# EAGLE design Raincenter_APP_TS_0.02 (EAGLE 6.6.0)
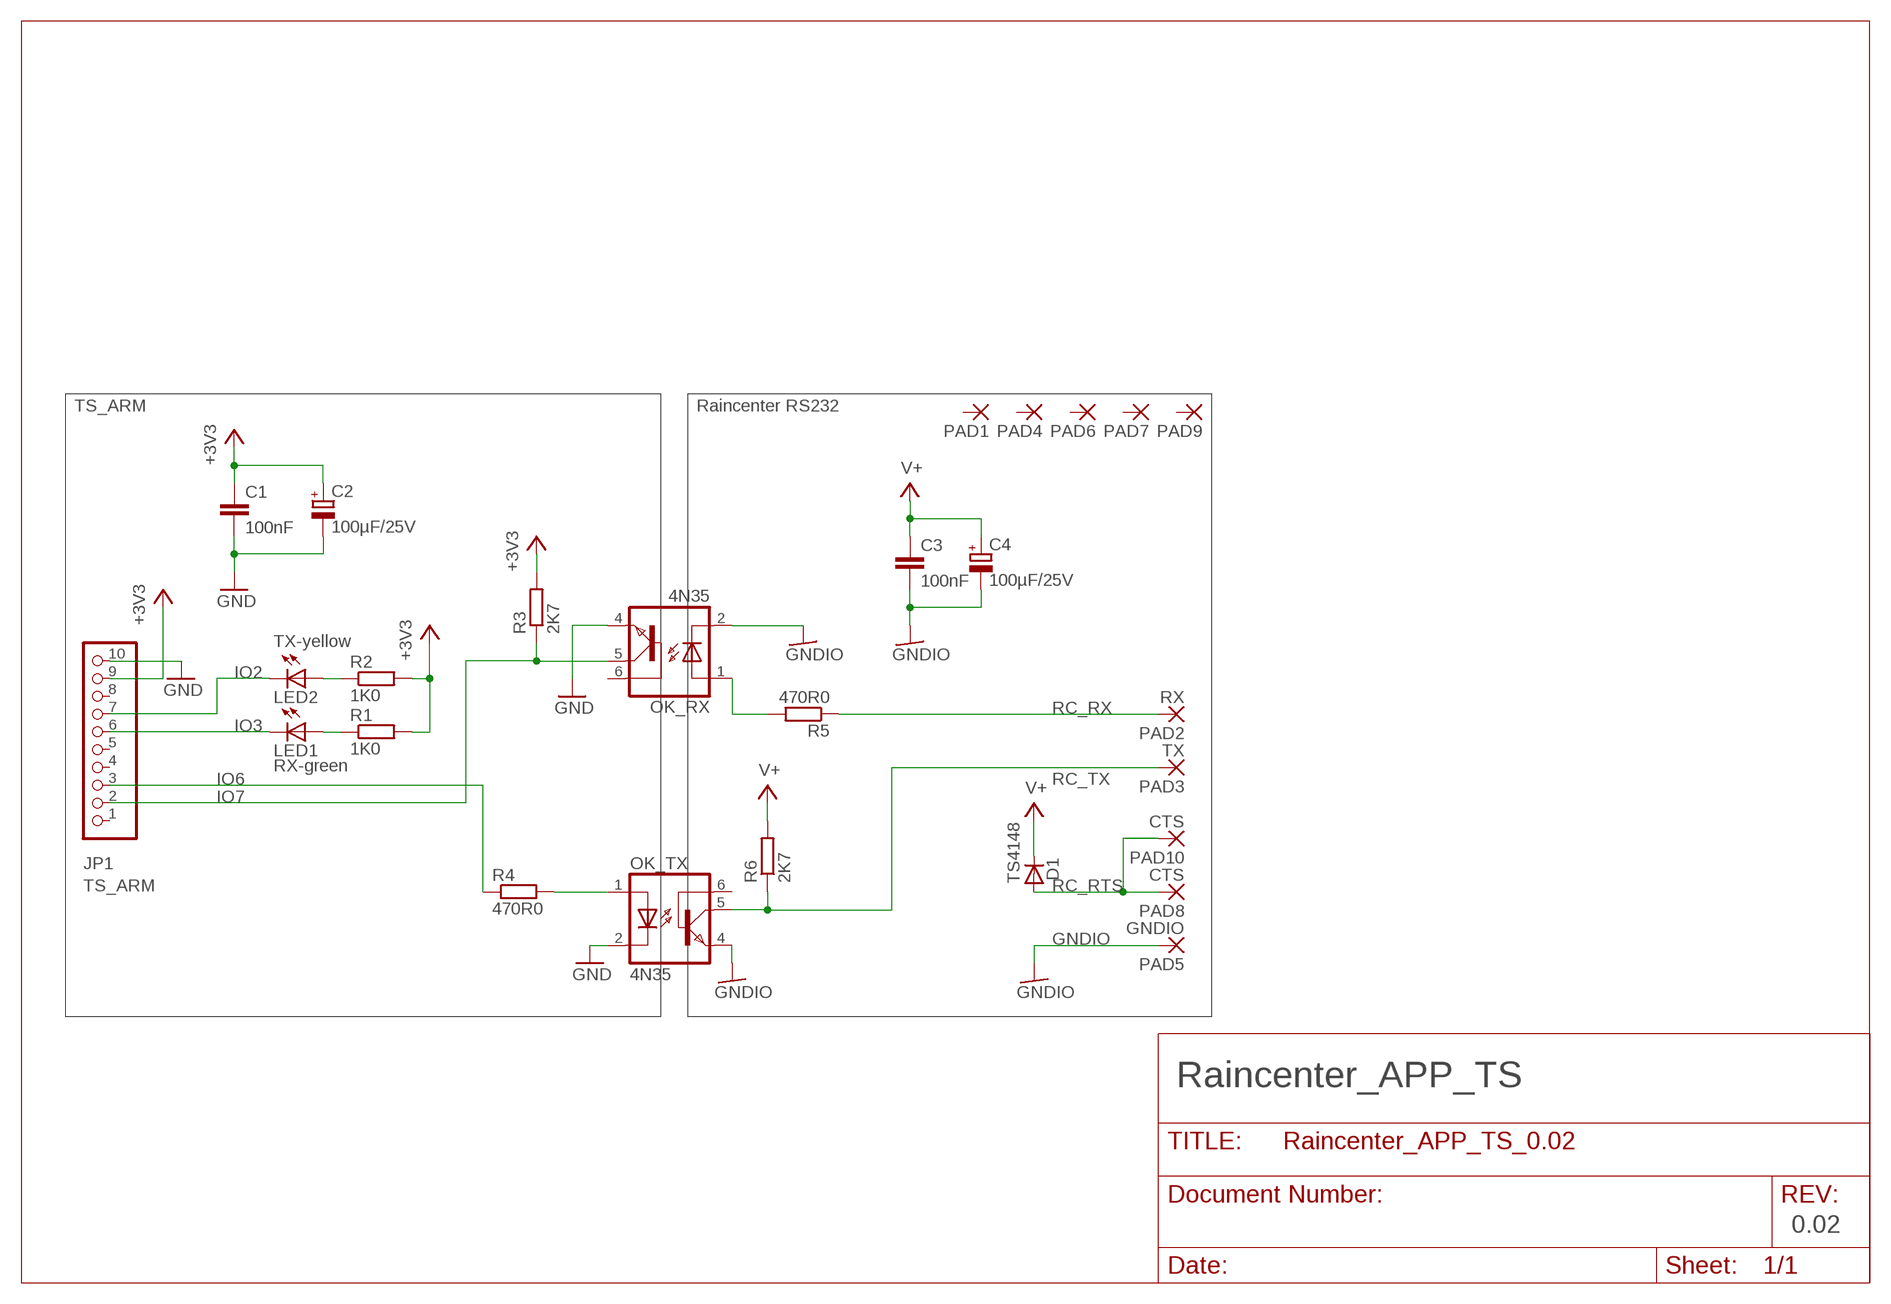
[diagram p0: schematic, sheet 1]

## Parts
C1  100nF  C-EUC1206K  [C1206K]
C2  100µF/25V  CPOL-EUD  [PANASONIC_D]
C3  100nF  C-EUC1206K  [C1206K]
C4  100µF/25V  CPOL-EUD  [PANASONIC_D]
D1  TS4148  [1206]
JP1  TS_ARM  PINHD-1X10  [1X10]
LED1  RX-green  LEDCHIPLED_1206  [CHIPLED_1206]
LED2  TX-yellow  LEDCHIPLED_1206  [CHIPLED_1206]
OK_RX  4N35  [DIL06]
OK_TX  4N35  [DIL06]
PAD1  WIREPADSMD1,27-254  [SMD1,27-2,54]
PAD2  RX  WIREPADSMD1,27-254  [SMD1,27-2,54]
PAD3  TX  WIREPADSMD1,27-254  [SMD1,27-2,54]
PAD4  WIREPADSMD1,27-254  [SMD1,27-2,54]
PAD5  GNDIO  WIREPADSMD1,27-254  [SMD1,27-2,54]
PAD6  WIREPADSMD1,27-254  [SMD1,27-2,54]
PAD7  WIREPADSMD1,27-254  [SMD1,27-2,54]
PAD8  CTS  WIREPADSMD1,27-254  [SMD1,27-2,54]
PAD9  WIREPADSMD1,27-254  [SMD1,27-2,54]
PAD10  CTS  WIREPADSMD1,27-254  [SMD1,27-2,54]
R1  1K0  R-EU_R1206  [R1206]
R2  1K0  R-EU_R1206  [R1206]
R3  2K7  R-EU_R1206  [R1206]
R4  470R0  R-EU_R1206  [R1206]
R5  470R0  R-EU_R1206  [R1206]
R6  2K7  R-EU_R1206  [R1206]

## Nets
+3V3: C1.1 C2.+ JP1.9 R1.2 R2.2 R3.2
GND: C1.2 C2.- JP1.10 OK_RX.4(EMI) OK_TX.2(C)
GNDIO: C3.2 C4.- OK_RX.2(C) OK_TX.4(EMI) PAD5.1(P)
IO2: JP1.7 LED2.C
IO3: JP1.6 LED1.C
IO6: JP1.3 R4.1
IO7: JP1.2 OK_RX.5(COL) R3.1
N$5: LED2.A R2.1
N$8: OK_RX.1(A) R5.2
N$10: OK_TX.1(A) R4.2
N$11: LED1.A R1.1
RC_RTS: D1.ANODE(A) PAD8.1(P) PAD10.1(P)
RC_RX: PAD2.1(P) R5.1
RC_TX: OK_TX.5(COL) PAD3.1(P) R6.1
V+: C3.1 C4.+ D1.KATHODE(K) R6.2
Unconnected: JP1.1 JP1.4 JP1.5 JP1.8 OK_RX.6(BAS) OK_TX.6(BAS) PAD1.1(P) PAD4.1(P) PAD6.1(P) PAD7.1(P) PAD9.1(P)

## Notes on the sheet
- TS_ARM | Raincenter RS232
- Raincenter_APP_TS
- 0.02

## Library data of the parts
C1 C3 = rcl:C-EU: CAPACITOR, European symbol; OC_REICHELT: X7R-G1206 100N
C2 C4 = rcl:CPOL-EU: POLARIZED CAPACITOR, European symbol; OC_REICHELT: VF 100/25 P-D8
D1 = kubi:TS4148; OC_REICHELT: TS 4148-1206
JP1 = pinhead:PINHD-1X10: PIN HEADER
LED1 = led:LED: LED OSRAM: - CHIPLED LG R971, LG N971, LY N971, LG Q971, LY Q971, LO R971, LY R971 LH N974, LH R974 LS Q976, LO Q976, LY Q976 LO Q996 - Hyper CHIPLED LW Q18S LB Q993, LB Q99A, LB R99A - SideLED LS A670, LO A670, LY A670, LG A670, LP A670 LB A673, LV A673, LT A673, LW A673 LH A674 LY A675 LS A676, LA A676, LO A676, LY A676, LW A676 LS A679, LY A679, LG A679 - Hyper Micro SIDELED® LS Y876, LA Y876, LO Y876, LY Y876 LT Y87S - SmartLED LW L88C, LW L88S LB L89C, LB L89S, LG L890 LS L89K, LO L89K, LY L89K LS L896, LA L896, LO L896, LY L896 - TOPLED LS T670, LO T670, LY T670, LG T670, LP T670 LSG T670, LSP T670, LSY T670, LOP T670, LYG T670 LG T671, LOG T671, LSG T671 LB T673, LV T673, LT T673, LW T673 LH T674 LS T676, LA T676, LO T676, LY T676, LB T676, LH T676, LSB T676, LW T676 LB T67C, LV T67C, LT T67C, LS T67K, LO T67K, LY T67K, LW E67C LS E67B, LA E67B, LO E67B, LY E67B, LB E67C, LV E67C, LT E67C LW T67C LS T679, LY T679, LG T679 LS T770, LO T770, LY T770, LG T770, LP T770 LB T773, LV T773, LT T773, LW T773 LH T774 LS E675, LA E675, LY E675, LS T675 LS T776, LA T776, LO T776, LY T776, LB T776 LHGB T686 LT T68C, LB T68C - Hyper Mini TOPLED® LB M676 - Mini TOPLED Santana® LG M470 LS M47K, LO M47K, LY M47K Source: http://www.osram.convergy.de - LUMILED® LXK2-PW12-R00, LXK2-PW12-S00, LXK2-PW14-U00, LXK2-PW14-V00 LXK2-PM12-R00, LXK2-PM12-S00, LXK2-PM14-U00 LXK2-PE12-Q00, LXK2-PE12-R00, LXK2-PE12-S00, LXK2-PE14-T00, LXK2-PE14-U00 LXK2-PB12-K00, LXK2-PB12-L00, LXK2-PB12-M00, LXK2-PB14-N00, LXK2-PB14-P00, LXK2-PB14-Q00 LXK2-PR12-L00, LXK2-PR12-M00, LXK2-PR14-Q00, LXK2-PR14-R00 LXK2-PD12-Q00, LXK2-PD12-R00, LXK2-PD12-S00 LXK2-PH12-R00, LXK2-PH12-S00 LXK2-PL12-P00, LXK2-PL12-Q00, LXK2-PL12-R00 Source: www.luxeon.com; OC_REICHELT: SMD-LED 1206 GN
LED2 = led:LED: LED OSRAM: - CHIPLED LG R971, LG N971, LY N971, LG Q971, LY Q971, LO R971, LY R971 LH N974, LH R974 LS Q976, LO Q976, LY Q976 LO Q996 - Hyper CHIPLED LW Q18S LB Q993, LB Q99A, LB R99A - SideLED LS A670, LO A670, LY A670, LG A670, LP A670 LB A673, LV A673, LT A673, LW A673 LH A674 LY A675 LS A676, LA A676, LO A676, LY A676, LW A676 LS A679, LY A679, LG A679 - Hyper Micro SIDELED® LS Y876, LA Y876, LO Y876, LY Y876 LT Y87S - SmartLED LW L88C, LW L88S LB L89C, LB L89S, LG L890 LS L89K, LO L89K, LY L89K LS L896, LA L896, LO L896, LY L896 - TOPLED LS T670, LO T670, LY T670, LG T670, LP T670 LSG T670, LSP T670, LSY T670, LOP T670, LYG T670 LG T671, LOG T671, LSG T671 LB T673, LV T673, LT T673, LW T673 LH T674 LS T676, LA T676, LO T676, LY T676, LB T676, LH T676, LSB T676, LW T676 LB T67C, LV T67C, LT T67C, LS T67K, LO T67K, LY T67K, LW E67C LS E67B, LA E67B, LO E67B, LY E67B, LB E67C, LV E67C, LT E67C LW T67C LS T679, LY T679, LG T679 LS T770, LO T770, LY T770, LG T770, LP T770 LB T773, LV T773, LT T773, LW T773 LH T774 LS E675, LA E675, LY E675, LS T675 LS T776, LA T776, LO T776, LY T776, LB T776 LHGB T686 LT T68C, LB T68C - Hyper Mini TOPLED® LB M676 - Mini TOPLED Santana® LG M470 LS M47K, LO M47K, LY M47K Source: http://www.osram.convergy.de - LUMILED® LXK2-PW12-R00, LXK2-PW12-S00, LXK2-PW14-U00, LXK2-PW14-V00 LXK2-PM12-R00, LXK2-PM12-S00, LXK2-PM14-U00 LXK2-PE12-Q00, LXK2-PE12-R00, LXK2-PE12-S00, LXK2-PE14-T00, LXK2-PE14-U00 LXK2-PB12-K00, LXK2-PB12-L00, LXK2-PB12-M00, LXK2-PB14-N00, LXK2-PB14-P00, LXK2-PB14-Q00 LXK2-PR12-L00, LXK2-PR12-M00, LXK2-PR14-Q00, LXK2-PR14-R00 LXK2-PD12-Q00, LXK2-PD12-R00, LXK2-PD12-S00 LXK2-PH12-R00, LXK2-PH12-S00 LXK2-PL12-P00, LXK2-PL12-Q00, LXK2-PL12-R00 Source: www.luxeon.com; OC_REICHELT: SMD-LED 1206 GE
OK_RX OK_TX = optocoupler:4N35: MOTOROLA OPTO COUPLER; MF: FAIRCHILD SEMICONDUCTOR; MPN: 4N35; OC_FARNELL: 1328375; OC_NEWARK: 72K9946; OC_REICHELT: 4N 35
PAD1-PAD10 = wirepad:WIREPAD: Wire PAD connect wire on PCB
R1 R2 = rcl:R-EU_: RESISTOR, European symbol; OC_REICHELT: RND 1206 1 1,0K
R3 R6 = rcl:R-EU_: RESISTOR, European symbol; OC_REICHELT: RND 1206 1 2,7K
R4 R5 = rcl:R-EU_: RESISTOR, European symbol; OC_REICHELT: RND 1206 1 470

## Net classes
0 default: width 0.61 mm
2 VCC: width 0.61 mm

## Board
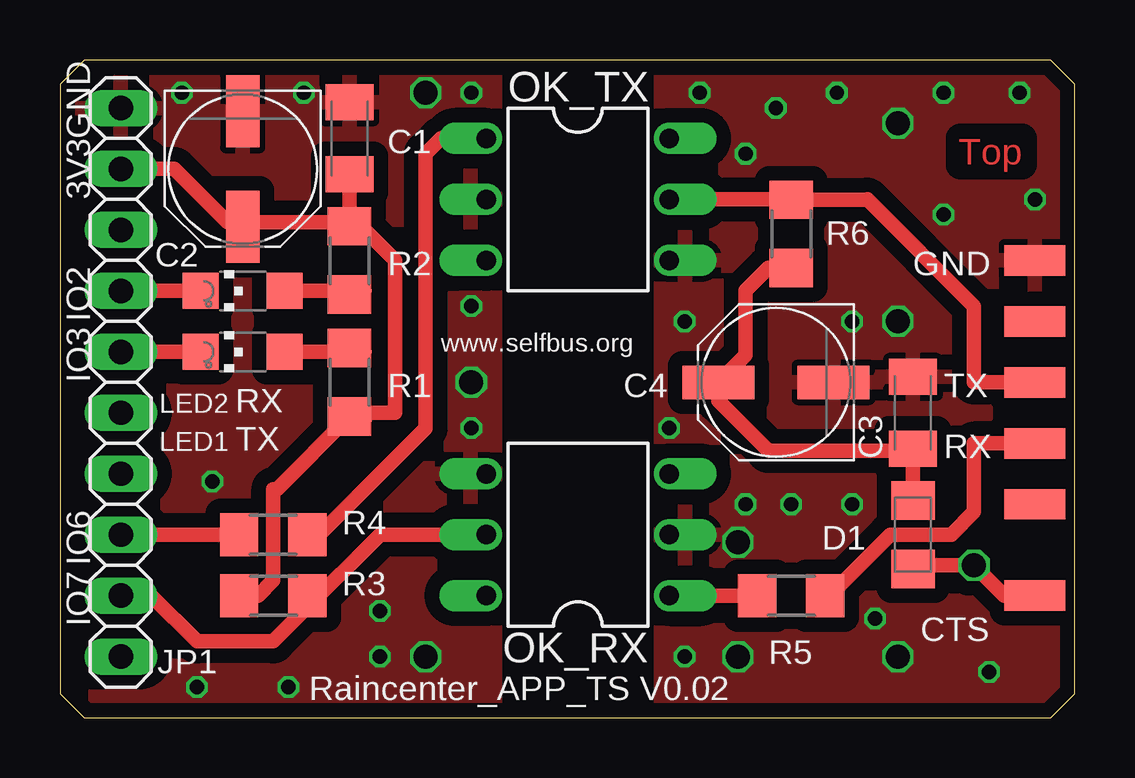
[diagram p1: board, top side]
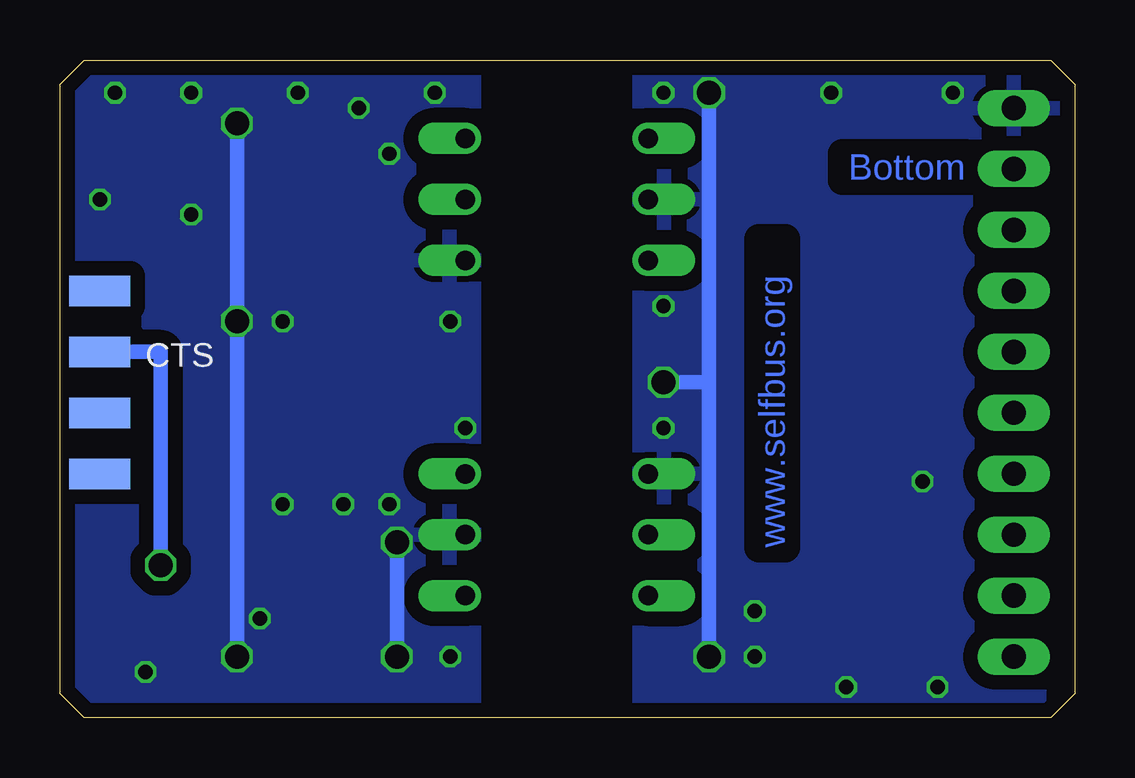
[diagram p2: board, bottom side, seen from below]

Size 42.3 x 27.4 mm. Coordinates in mm from the lower left corner, seen from the top.
Outline: 0,1 1,0 41.3,0 42.3,1 42.3,26.4 41.3,27.4 1,27.4 0,26.4 0,1
Copper layers (1*16): Top 0.035mm / dielectric 1.5mm / Bottom 0.035mm
Design rules "aisler_2_layer *": minimum track width 0.1mm, minimum drill 0.2mm, track to track 0.15mm, track to pad 0.1mm, pad to pad 0.1mm, via to via 0.1mm, smd to smd 0.1mm, copper to edge 0.2mm, drill to drill 0.21mm, minimum pad ring 0.25mm, minimum via ring 0.15mm, stop-mask expansion 0mil, vias tented up to drill 50mil, thermal gap 10mil
tRestrict: area 19.1,-1.3 to 24.1,27.9
bRestrict: area 19.1,-1.3 to 24.1,27.9

### Footprints (pad centres in the part's own frame; a part is rotated, then mirrored left to right if it is on the bottom)
C1206K = smd 1.5 x 2: 1 -1.5,0; 2 1.5,0
PANASONIC_D = smd 3 x 1.4: + 2.4,0; - -2.4,0
1206 = smd 1.6 x 1.803: ANODE 1.422,0; KATHODE -1.422,0
1X10 = drill 1.016 long: 1 -11.43,0; 2 -8.89,0; 3 -6.35,0; 4 -3.81,0; 5 -1.27,0; 6 1.27,0; 7 3.81,0; 8 6.35,0; 9 8.89,0; 10 11.43,0
CHIPLED_1206 = smd 1.5 x 1.5: A 0,-1.75; C 0,1.75
DIL06 = drill 0.813 offset: 1 -2.54,-3.81; 2 0,-3.81; 3 2.54,-3.81; 4 2.54,3.81; 5 0,3.81; 6 -2.54,3.81
SMD1,27-2,54 = smd 1.27 x 2.54: 1 0,0
R1206 = smd 1.6 x 1.803: 1 -1.422,0; 2 1.422,0

### Placement (x,y rotation side)
C1  12.06,24.13 90 top
C2  7.62,22.86 270 top
C3  35.56,12.7 90 top
C4  29.84,13.97 180 top
D1  35.56,7.62 270 top
JP1  2.54,13.97 90 top
LED1  7.62,15.24 90 top
LED2  7.62,17.78 90 top
OK_RX  21.59,7.62 90 top
OK_TX  21.59,21.59 270 top
PAD1  40.64,8.89 90 top
PAD2  40.64,11.43 90 top
PAD3  40.64,13.97 90 top
PAD4  40.64,16.51 90 top
PAD5  40.64,19.05 90 top
PAD6  40.64,10.16 90 bottom
PAD7  40.64,12.7 90 bottom
PAD8  40.64,15.24 90 bottom
PAD9  40.64,17.78 90 bottom
PAD10  40.64,5.08 90 top
R1  12.06,13.97 270 top
R2  12.06,19.05 90 top
R3  8.89,5.08 180 top
R4  8.89,7.62 0 top
R5  30.48,5.08 180 top
R6  30.48,20.16 270 top

### Tracks (layer width: path | path; a pad name or v marks a point on that pad's centre or on a via)
+3V3
  Top 0.61: 12.7,12.38 R1.2 | C1.1 12.06,20.64 | 7.62,20.64 12.06,20.64 | 12.06,20.64 R2.2 12.55,20.47 13.97,19.05 13.97,12.7 12.22,12.7 R1.2 | 7.62,20.64 7.62,21.27 | 7.62,20.64 C2.+ 7.44,20.64 6.99,20.64 4.76,22.86 JP1.9 | R3.2 8.26,5.08 8.89,5.71 8.89,9.53 9.04,9.53 R1.2
GND  (via drill 0.6, 1)
  Bottom 0.61: v15.24,2.54 15.24,13.97 | 15.24,13.97 v15.24,26.04 | v17.14,13.97 15.24,13.97
  other vias: 5.71,1.27 9.53,1.27 13.34,2.54 13.34,4.45 6.35,9.84 17.14,12.06 17.14,17.14 5.08,26.04 17.14,26.04 10.16,26.04
  pour Top (isolate 0.61, rank 2): 0,27.94 19.68,27.78 19.68,0.16 0,0.32
  pour Bottom (isolate 0.61, rank 2): 0,27.94 19.68,27.78 19.68,0.16 0,0.32
GNDIO  (via drill 0.6, 1)
  Bottom 0.61: v34.92,24.77 v34.92,16.51 v34.92,2.54 | v28.26,2.54 v28.26,7.3
  other vias: 29.84,25.4 26.67,26.04 32.38,26.04 36.83,26.04 40.01,26.04 40.64,21.59 36.83,20.95 28.57,23.5 26.04,16.51 33.02,16.51 33.02,8.89 30.48,8.89 28.57,8.89 26.04,2.54 38.73,1.91 33.97,4.13 25.4,12.06
  pour Top (isolate 0.61, rank 2): 23.5,27.94 42.55,27.78 42.55,0.16 23.5,0.32
  pour Bottom (isolate 0.61, rank 2): 23.5,27.94 42.55,27.78 42.55,0.16 23.5,0.32
IO2
  Top 0.61: JP1.7 LED2.C
IO3
  Top 0.61: JP1.6 LED1.C
IO6
  Top 0.61: JP1.3 R4.1
IO7
  Top 0.61: JP1.2 3.81,5.08 5.71,3.17 8.89,3.17 10.16,4.45 | 10.16,4.45 10.16,5.08 R3.1 | OK_RX.5 13.34,7.62 10.16,4.45
N$5
  Top 0.61: LED2.A 12.7,17.78 R2.1
N$8
  Top 0.61: OK_RX.1 R5.2
N$10
  Top 0.61: OK_TX.1 15.88,24.13 15.24,23.5 15.24,12.06 10.79,7.62 R4.2
N$11
  Top 0.61: LED1.A 12.7,15.24 R1.1
RC_RTS  (via drill 1)
  Top 0.61: D1.ANODE 35.56,6.35 v38.1,6.35 39.37,5.08 PAD10.1
  Bottom 0.61: v38.1,6.35 38.1,15.24 PAD8.1
RC_RX
  Top 0.61: PAD2.1 38.1,11.43 38.1,8.57 37.15,7.62 34.61,7.62 32.07,5.08 R5.1
RC_TX
  Top 0.61: PAD3.1 38.1,13.97 38.1,17.14 33.66,21.59 33.64,21.58 R6.1 30.47,21.59 OK_TX.5
V+
  Top 0.61: 35.56,11.11 D1.KATHODE | 26.99,13.97 26.99,14.29 | 35.56,11.11 29.53,11.11 27.45,13.2 C4.+ | 26.99,13.97 26.99,13.65 | 35.56,11.11 C3.1 | 26.99,13.97 C4.+ | R6.2 29.53,18.73 28.57,17.78 28.57,15.1 C4.+

### Text on the board
Top: Top
Bottom: Bottom | www.selfbus.org
tNames: GND | 3V3 | GND | IO2 | www.selfbus.org | IO3 | RX | TX | TX | RX | IO6 | IO7 | CTS | Raincenter_APP_TS V0.02
bNames: CTS